# Altium schematic sheet POWER_4.SchDoc
size A; SheetNumber: 6; SheetTotal: 13
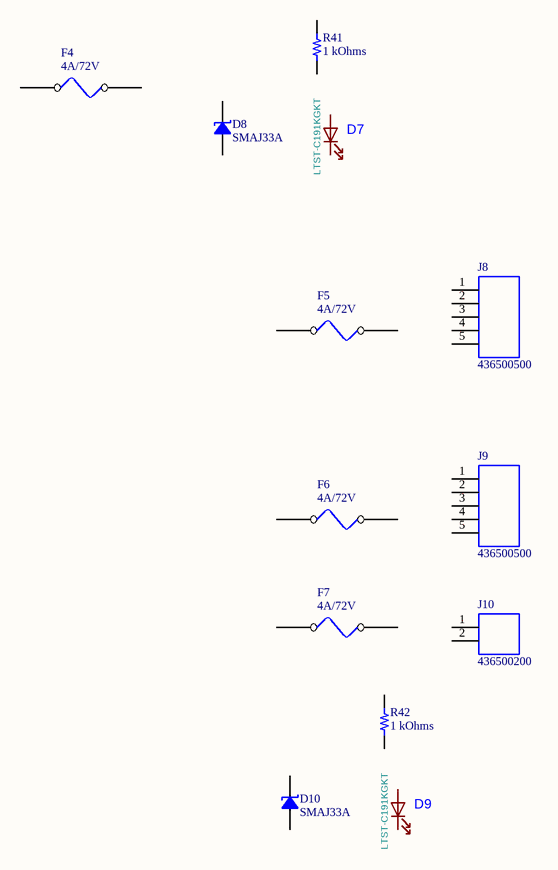
[diagram p0: POWER_4.SchDoc]

## Parts
D7  LTST-C191KGKT  [LED0603]
D8  SMAJ33A  [DO214AC SMA]
D9  LTST-C191KGKT  [LED0603]
D10  SMAJ33A  [DO214AC SMA]
F4  4A/72V  [F1206]
F5  4A/72V  [F1206]
F6  4A/72V  [F1206]
F7  4A/72V  [F1206]
J8  436500500  [CONN_SD-43650-001_05_MOL]
J9  436500500  [CONN_SD-43650-001_05_MOL]
J10  436500200  [CONN_SD-43650-001_02_MOL]
R41  1 kOhms  [RES 0603_1608]
R42  1 kOhms  [RES 0603_1608]

## Nets

Not connected (* = marked no-connect by the designer): D7 1(A) 2(K); D8 1 2; D9 1(A) 2(K); D10 1 2; F4 1 2; F5 1 2; F6 1 2; F7 1 2; J8 1 2 3 4 5; J9 1 2 3 4 5; J10 1 2; R41 1 2; R42 1 2

## Library data of the parts
D7 D9 = LED: LED, Bright Green, 0603; Manufacturer: Lite-On Inc.; Footprint: LED_SMD:LED_0603_1608Metric; Manufacturer Part Number: LTST-C191KGKT; Supplier Part Number: 160-1446-1-ND; Value: LTST-C191KGKT
D8 D10 = SMAJ33A: TVS DIODE 33VWM 53.3VC DO214AC; Manufacturer: Littelfuse Inc.; Current - Peak Pulse (10/1000µs): 7.5A; Power Line Protection: No; Power - Peak Pulse: 400W; Type: Zener; Unidirectional Channels: 1; Voltage - Breakdown (Min): 36.7V; Voltage - Clamping (Max) @ Ipp: 53.3V; Voltage - Reverse Standoff (Typ): 33V; Part Number: SMAJ33A; Applications: General Purpose; ComponentLink1Description: Datasheet; ComponentLink1URL: https://www.littelfuse.com/~/media/electronics/datasheets/tvs_diodes/littelfuse_tvs_diode_smaj_datasheet.pdf.pdf; ComponentLink2Description: DigiKey Link; ComponentLink2URL: https://www.digikey.com/en/products/detail/littelfuse-inc/SMAJ33A/762296; LastUpdated: 5.04.2026 20:34:16; Lifecycle Status: Active; Minimum Order: 1; Mounting Type: Surface Mount; Operating Temperature: -65°C ~ 150°C (TJ); Package / Case: DO-214AC, SMA; Packaging: TapeAndReel; PartId: 5718; Part Status: Active; Price: 0.06; Series: SMAJ; Supplier 1: DigiKey; Supplier Part Number 1: SMAJ33ALFCT-ND; Supplier Device Package: DO-214AC (SMA)
F4-F7 = Fuse: Fuse,Resettable 4A 75V,SMD 1206,TLC; Manufacturer P/N: F12F4; Myir P/N: 20801.00014; Datasheet: F12F Series.pdf; Reserve Value: 4A; Manufacturer: TLC; Part Type: Resettable Fuse; PCB Footprint: F1206
J8 J9 = 436500500: Connector Header Through Hole, Right Angle 5 position 0.118 (3.00mm); MF: Molex; SnapEDA_Link: https://www.snapeda.com/parts/436500500/Molex/view-part/?ref=snap; Package: None; Value: *; MP: 436500500; Check_prices: https://www.snapeda.com/parts/436500500/Molex/view-part/?ref=eda
J10 = 436500200: Connector Header Through Hole, Right Angle 2 position 0.118 (3.00mm); MF: Molex; SnapEDA_Link: https://www.snapeda.com/parts/436500200/Molex/view-part/?ref=snap; Package: None; Value: *; MP: 436500200; Check_prices: https://www.snapeda.com/parts/436500200/Molex/view-part/?ref=eda
R41 R42 = RMCF0603FG1K00: RES 1K OHM 1% 1/10W 0603; Manufacturer: Stackpole Electronics Inc; Power (Watts): 0.1W, 1/10W; Temperature Coefficient: ±100ppm/°C; Part Number: RMCF0603FG1K00; Value: 1 kOhms; ComponentLink1Description: Datasheet; ComponentLink1URL: https://www.seielect.com/catalog/sei-packaging.pdf; ComponentLink2Description: DigiKey Link; ComponentLink2URL: https://www.digikey.com/en/products/detail/stackpole-electronics-inc/RMCF0603FG1K00/1713699; Composition: Thick Film; Device Package: 0603 (1608 Metric); Features: Automotive AEC-Q200; Height - Seated (Max): 0.022" (0.55mm); LastUpdated: 9.02.2024 20:42:15; Lifecycle Status: Active; Minimum Order: 1; Number of Terminations: 2; Operating Temperature: -55°C ~ 155°C; Package / Case: 0603 (1608 Metric); Packaging: CutTape; PartId: 24034; Part Status: Active; Price: 0.01; Ratings: AEC-Q200; Resistance: 1 kOhms; Series: RMCF; Size / Dimension: 0.061" L x 0.031" W (1.55mm x 0.80mm); Supplier 1: DigiKey; Supplier Part Number 1: RMCF0603FG1K00CT-ND; Supplier Device Package: 0603; Tolerance: ±1%